# Altium schematic sheet Channel.SchDoc
size A4; SheetNumber: 2; SheetTotal: 5
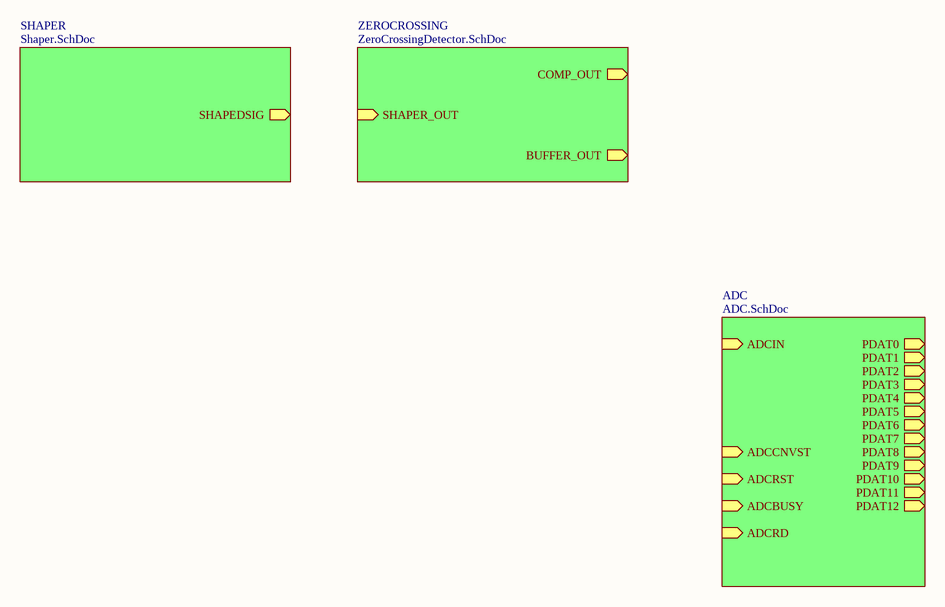
[diagram p0: Channel.SchDoc]

## Sub-sheets
ADC = ADC.SchDoc: ADCIN (in), ADCCNVST (in), ADCRST (in), ADCBUSY (in), ADCRD (in), PDAT0 (out), PDAT1 (out), PDAT2 (out), PDAT3 (out), PDAT4 (out), PDAT5 (out), PDAT6 (out), PDAT7 (out), PDAT8 (out), PDAT9 (out), PDAT10 (out), PDAT11 (out), PDAT12 (out)
SHAPER = Shaper.SchDoc: SHAPEDSIG (out)
ZEROCROSSING = ZeroCrossingDetector.SchDoc: SHAPER_OUT (in), COMP_OUT (out), BUFFER_OUT (out)